# Altium schematic sheet 05 POWER-SUPPLY.SchDoc
size A4
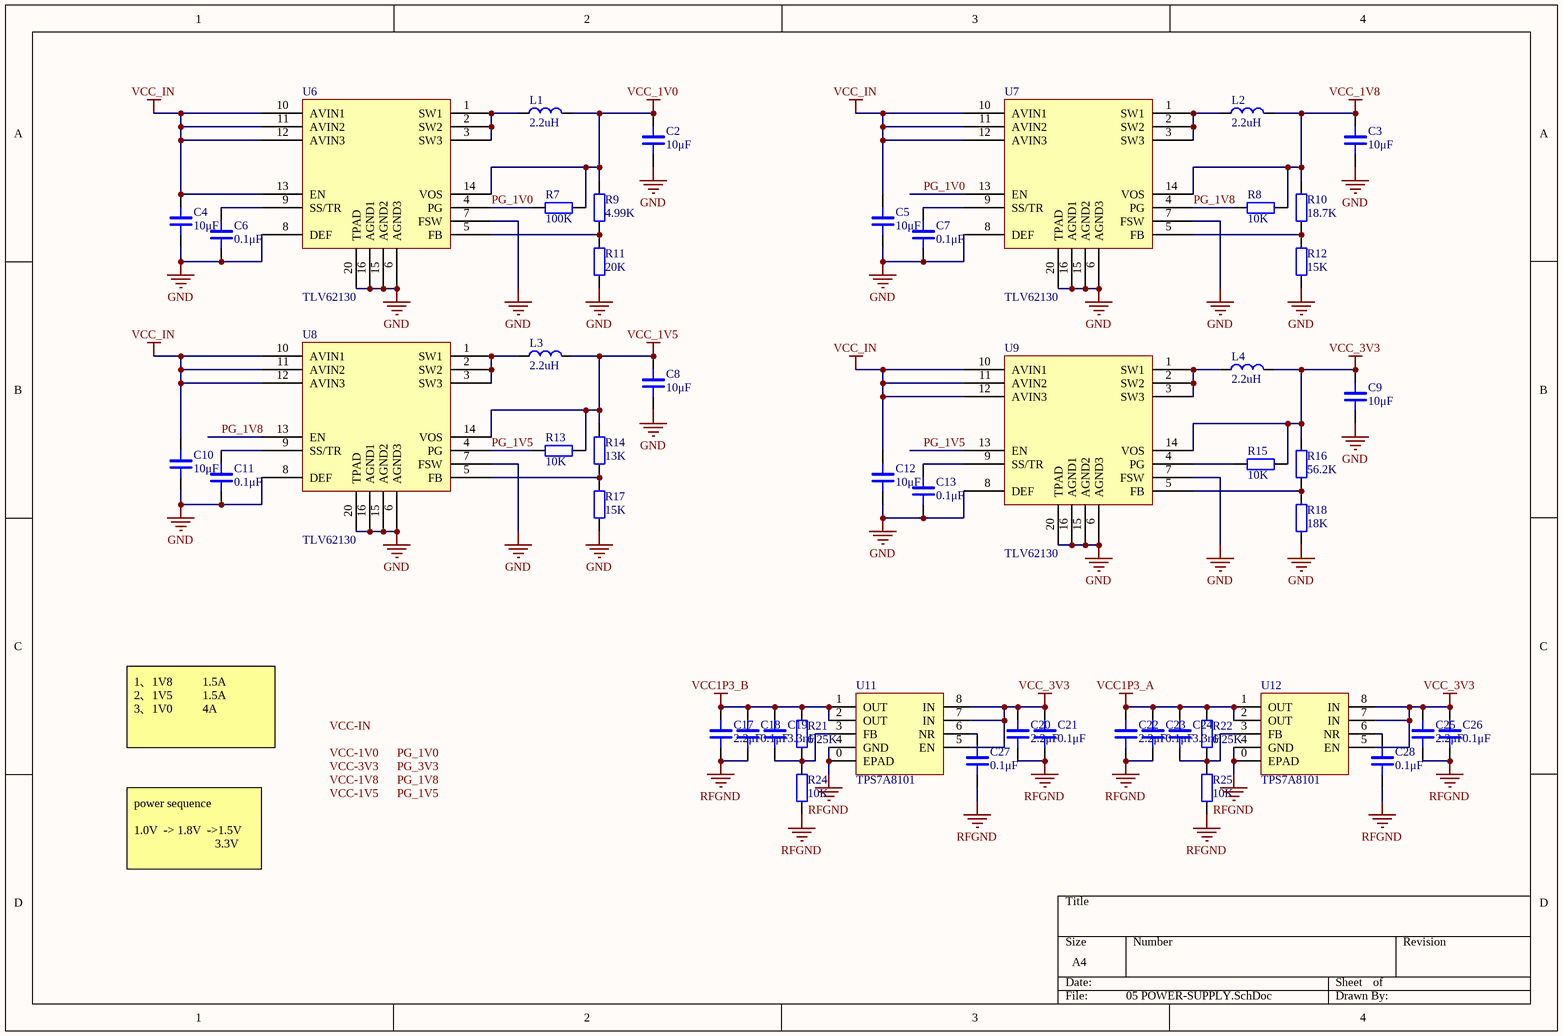
[diagram p0: 05 POWER-SUPPLY.SchDoc]

## Parts
C2  10μF  [LC-0805_C]
C3  10μF  [LC-0805_C]
C4  10μF  [LC-0805_C]
C5  10μF  [LC-0805_C]
C6  0.1μF  [LC-0402_C]
C7  0.1μF  [LC-0402_C]
C8  10μF  [LC-0805_C]
C9  10μF  [LC-0805_C]
C10  10μF  [LC-0805_C]
C11  0.1μF  [LC-0402_C]
C12  10μF  [LC-0805_C]
C13  0.1μF  [LC-0402_C]
C17  2.2μF  [LC-0805_C]
C18  0.1μF  [LC-0402_C]
C19  3.3nF  [LC-0402_C]
C20  2.2μF  [LC-0402_C]
C21  0.1μF  [LC-0805_C]
C22  2.2μF  [LC-0805_C]
C23  0.1μF  [LC-0402_C]
C24  3.3nF  [LC-0402_C]
C25  2.2μF  [LC-0402_C]
C26  0.1μF  [LC-0805_C]
C27  0.1μF  [LC-0402_C]
C28  0.1μF  [LC-0402_C]
L1  2.2uH  [L1008]
L2  2.2uH  [L1008]
L3  2.2uH  [L1008]
L4  2.2uH  [L1008]
R7  100K  [LC-0402_R]
R8  10K  [LC-0402_R]
R9  4.99K  [LC-0402_R]
R10  18.7K  [LC-0402_R]
R11  20K  [LC-0402_R]
R12  15K  [LC-0402_R]
R13  10K  [LC-0402_R]
R14  13K  [LC-0402_R]
R15  10K  [LC-0402_R]
R16  56.2K  [LC-0402_R]
R17  15K  [LC-0402_R]
R18  18K  [LC-0402_R]
R21  6.25K  [LC-0402_R]
R22  6.25K  [LC-0402_R]
R24  10K  [LC-0402_R]
R25  10K  [LC-0402_R]
U6  TLV62130  [TLV62130RGT]
U7  TLV62130  [TLV62130RGT]
U8  TLV62130  [TLV62130RGT]
U9  TLV62130  [TLV62130RGT]
U11  TPS7A8101  [TPS7A8101]
U12  TPS7A8101  [TPS7A8101]

## Nets
GND: C2.1 C3.1 C4.1 C5.1 C6.1 C7.1 C8.1 C9.1 C10.1 C11.1 C12.1 C13.1 R11.2 R12.2 R17.2 R18.2 U6.6(AGND3) U6.7(FSW) U6.8(DEF) U6.15(AGND2) U6.16(AGND1) U6.20(TPAD) U7.6(AGND3) U7.7(FSW) U7.8(DEF) U7.15(AGND2) U7.16(AGND1) U7.20(TPAD) U8.6(AGND3) U8.7(FSW) U8.8(DEF) U8.15(AGND2) U8.16(AGND1) U8.20(TPAD) U9.6(AGND3) U9.7(FSW) U9.8(DEF) U9.15(AGND2) U9.16(AGND1) U9.20(TPAD)
RFGND: C17.1 C18.1 C20.1 C21.1 C22.1 C23.1 C25.1 C26.1 C27.1 C28.1 R24.2 R25.2 U11.0(EPAD) U11.4(GND) U12.0(EPAD) U12.4(GND)
VCC1P3_A: C22.2 C23.2 C24.2 R22.1 U12.1(OUT) U12.2(OUT)
VCC1P3_B: C17.2 C18.2 C19.2 R21.1 U11.1(OUT) U11.2(OUT)
VCC_1V0: C2.2 L1.2 R7.1 R9.1 U6.14(VOS)
VCC_1V5: C8.2 L3.2 R13.1 R14.1 U8.14(VOS)
VCC_1V8: C3.2 L2.2 R8.1 R10.1 U7.14(VOS)
VCC_3V3: C9.2 C20.2 C21.2 C25.2 C26.2 L4.2 R15.1 R16.1 U9.14(VOS) U11.5(EN) U11.7(IN) U11.8(IN) U12.5(EN) U12.7(IN) U12.8(IN)
VCC_IN: C4.2 C5.2 C10.2 C12.2 U6.10(AVIN1) U6.11(AVIN2) U6.12(AVIN3) U6.13(EN) U7.10(AVIN1) U7.11(AVIN2) U7.12(AVIN3) U8.10(AVIN1) U8.11(AVIN2) U8.12(AVIN3) U9.10(AVIN1) U9.11(AVIN2) U9.12(AVIN3)
PG_1V0: R7.2 U6.4(PG) U7.13(EN)
PG_1V5: R13.2 U8.4(PG) U9.13(EN)
PG_1V8: R8.2 U7.4(PG) U8.13(EN)
NetC6_2: C6.2 U6.9(SS/TR)
NetC7_2: C7.2 U7.9(SS/TR)
NetC11_2: C11.2 U8.9(SS/TR)
NetC13_2: C13.2 U9.9(SS/TR)
NetC19_1: C19.1 R21.2 R24.1 U11.3(FB)
NetC24_1: C24.1 R22.2 R25.1 U12.3(FB)
NetC27_2: C27.2 U11.6(NR)
NetC28_2: C28.2 U12.6(NR)
NetL1_1: L1.1 U6.1(SW1) U6.2(SW2) U6.3(SW3)
NetL2_1: L2.1 U7.1(SW1) U7.2(SW2) U7.3(SW3)
NetL3_1: L3.1 U8.1(SW1) U8.2(SW2) U8.3(SW3)
NetL4_1: L4.1 U9.1(SW1) U9.2(SW2) U9.3(SW3)
NetR9_2: R9.2 R11.1 U6.5(FB)
NetR10_2: R10.2 R12.1 U7.5(FB)
NetR14_2: R14.2 R17.1 U8.5(FB)
NetR15_2: R15.2 U9.4(PG)
NetR16_2: R16.2 R18.1 U9.5(FB)

## Notes on the sheet
- 1、1V8          1.5A
  2、1V5          1.5A
  3、1V0          4A
- 1.3V
- power sequence
  1.0V  -> 1.8V  ->1.5V
  3.3V
- Labels drawn without touching a wire or pin: PG_1V0, PG_1V5, PG_1V8, PG_3V3, VCC-1V0, VCC-1V5, VCC-1V8, VCC-3V3, VCC-IN

## Library data of the parts
C2-C13 C17-C28 = CAP_3: Capacitor
L1-L4 = INDUCTANCE_1: Inductance
R7-R18 R21 R22 R24 R25 = RES: Resistor